# EAGLE design Sticker_Alignment_Jig (EAGLE 9.6.2)
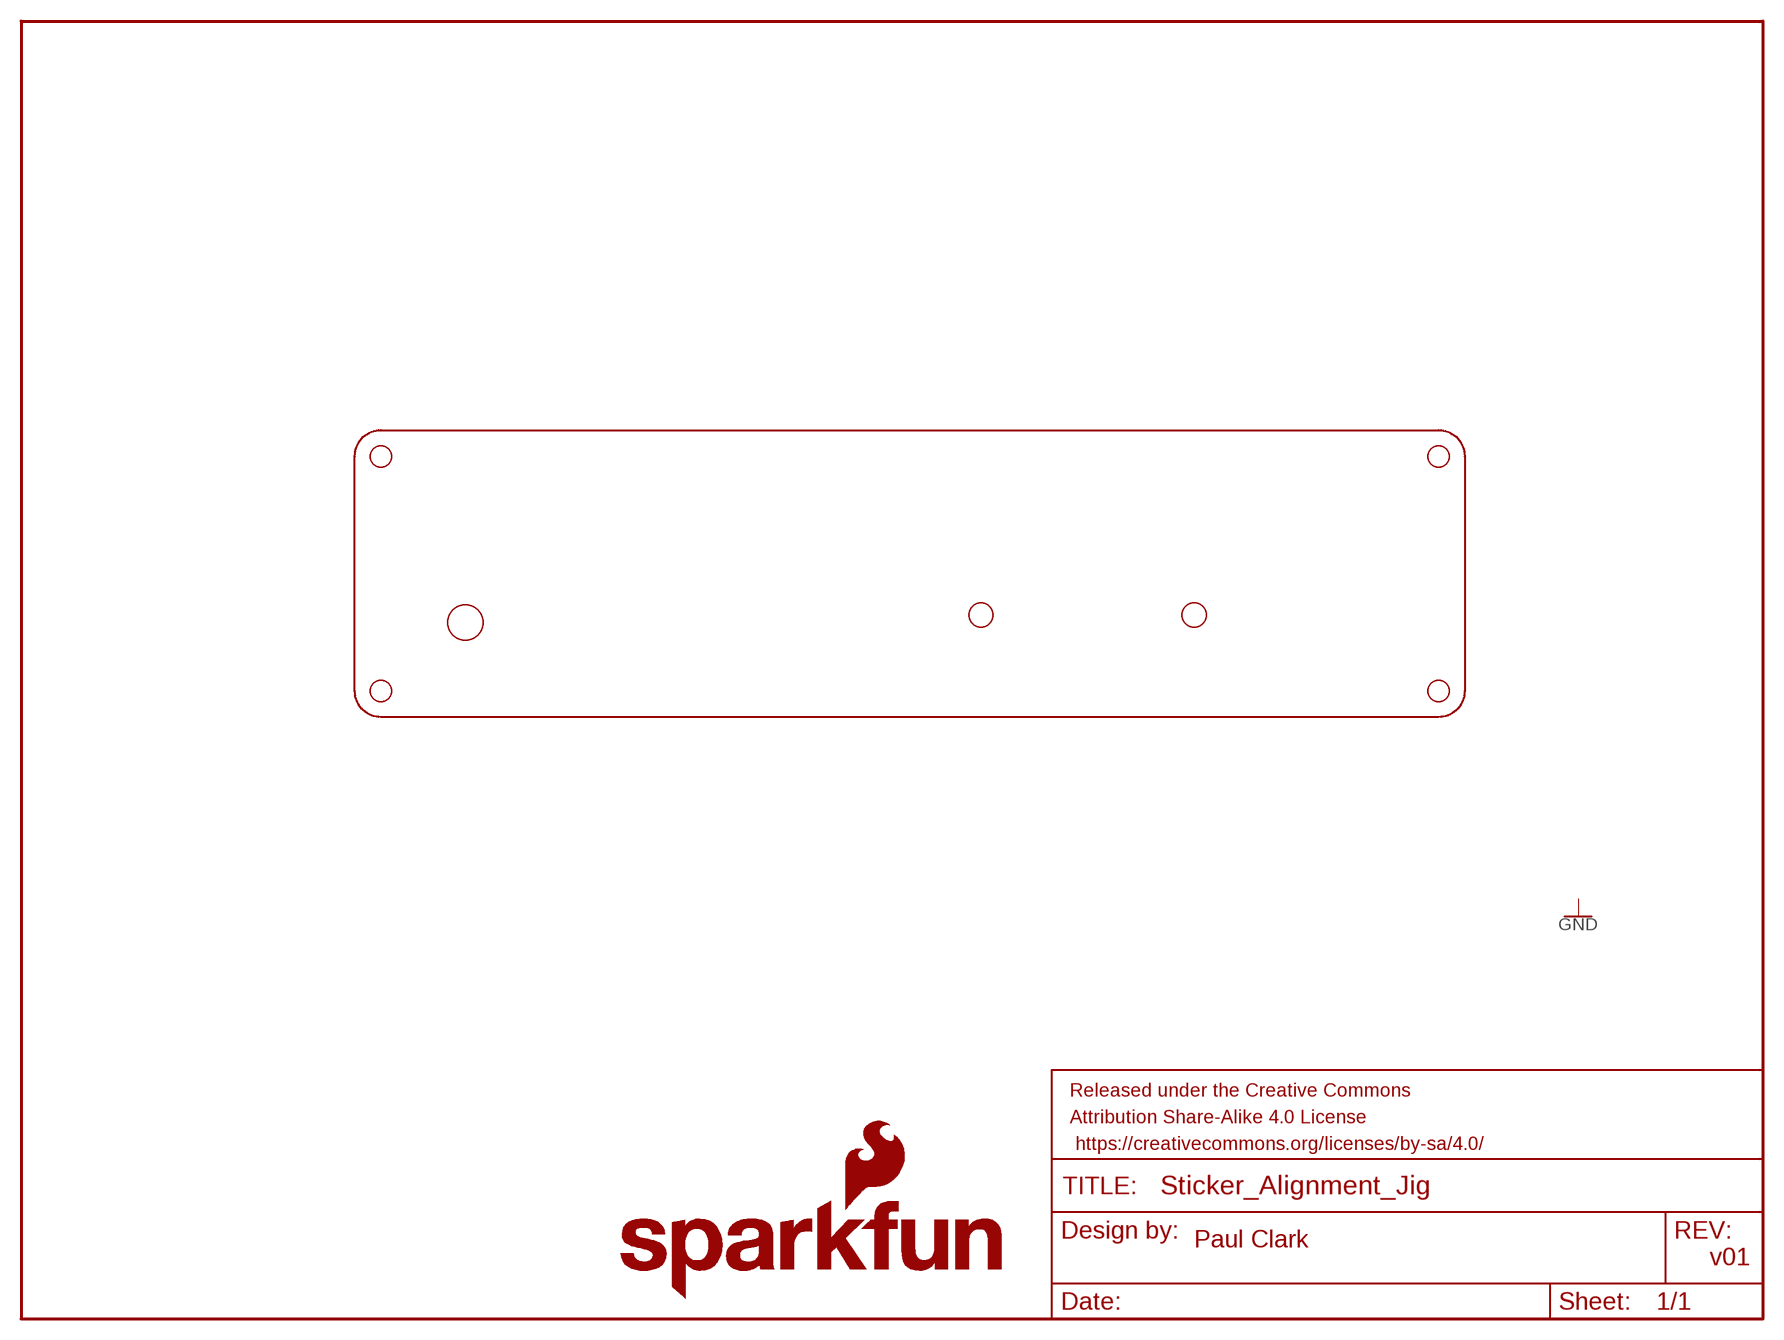
[diagram p0: schematic, sheet 1]

## Parts
FRAME1  FRAME-LETTER  [CREATIVE_COMMONS]
LOGO1  SFE_LOGO_NAME_FLAME.3_INCH  [SFE_LOGO_NAME_FLAME_.3]
U$2  PANEL_OUTLINE  [PANEL_OUTLINE]
U$3  LED  [LED]
U$13  BUTTON  [BUTTON]
U$14  BUTTON  [BUTTON]

## Notes on the sheet
- Paul Clark
- v01

## Library data of the parts
FRAME1 = SparkFun-Aesthetics:FRAME-LETTER: Schematic Frame - Letter Standard 8.5x11 US Letter frame
LOGO1 = SparkFun-Aesthetics:SFE_LOGO_NAME_FLAME: SparkFun Font Logo w/ Flame This is the SparkFun full logo. The logo on the schematic will always be the same size; the package variant is the height of the flame part of the logo. Default layer for the logo on the board is tSilk.
U$2 = CORS_Panels:PANEL_OUTLINE: Panel Outline Centered on the top surface of the PCB
U$3 = CORS_Panels:LED
U$13 U$14 = CORS_Panels:BUTTON

## Board
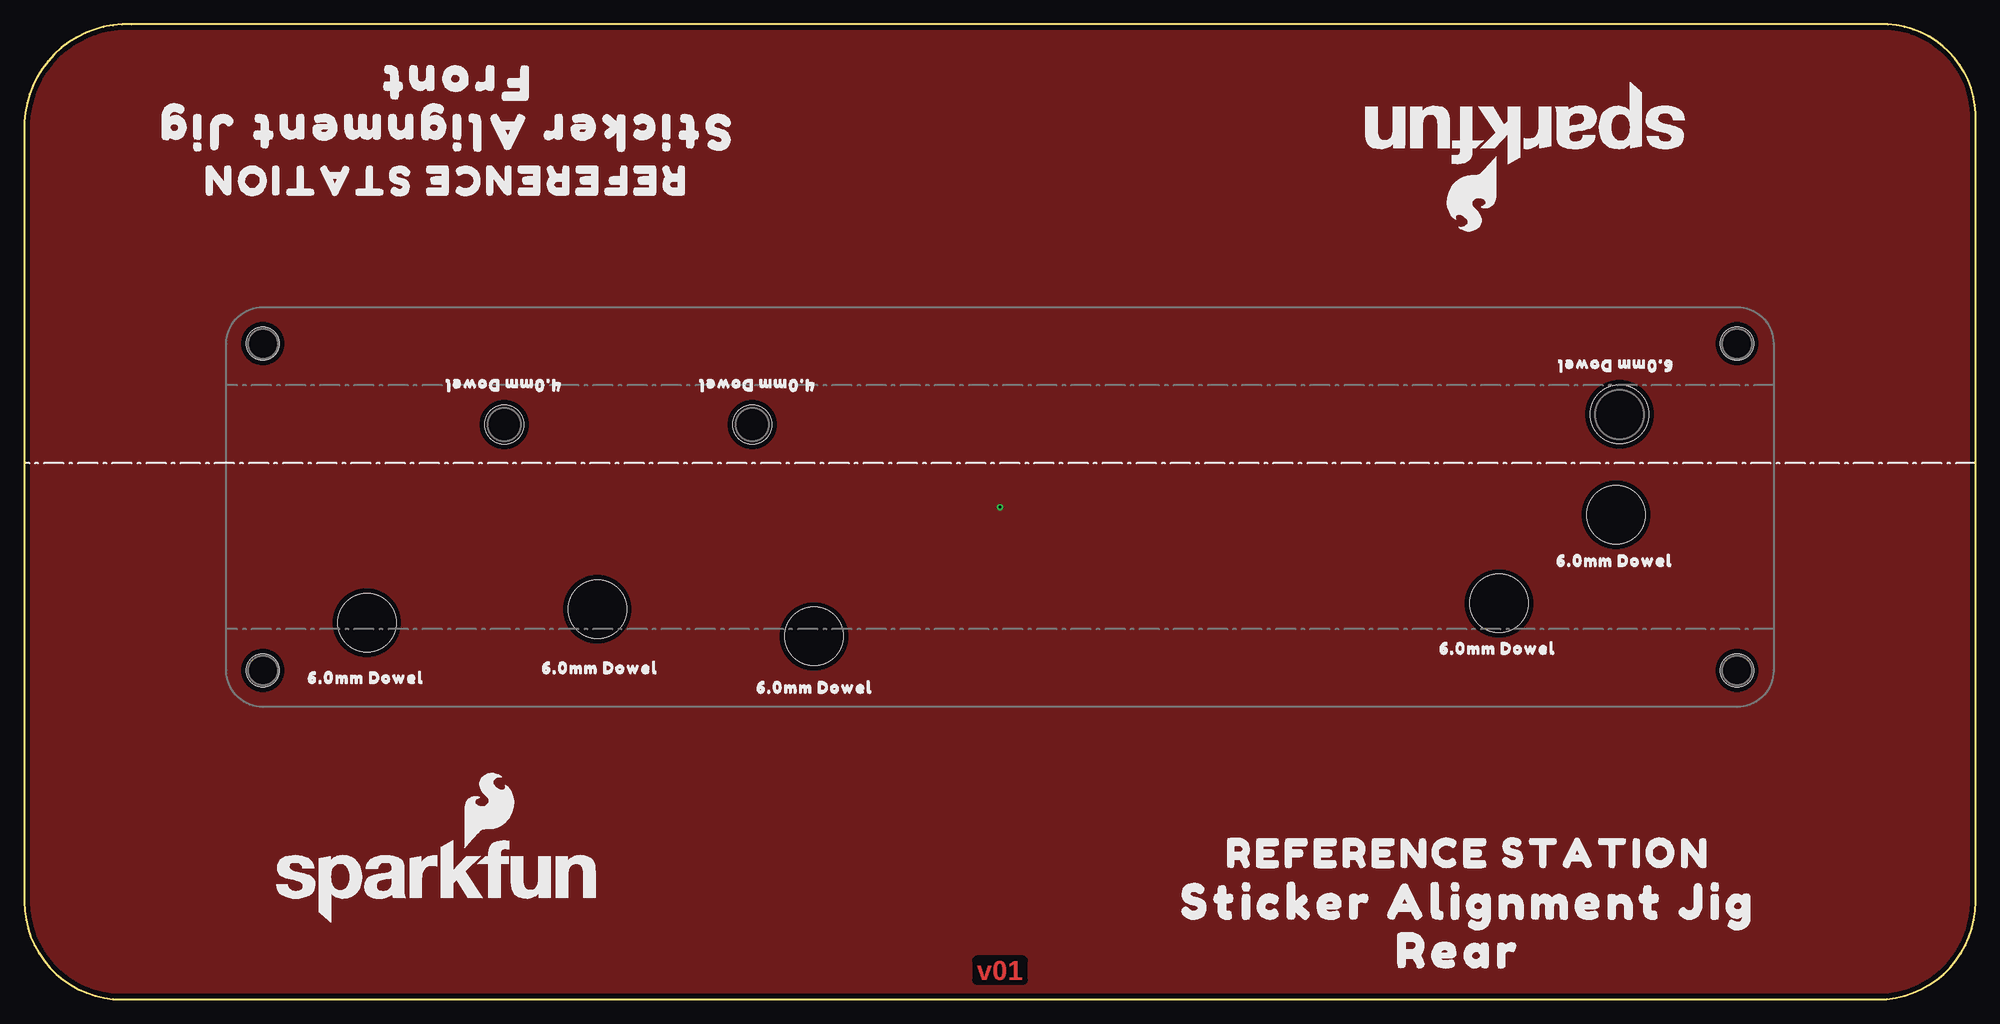
[diagram p1: board, top side]
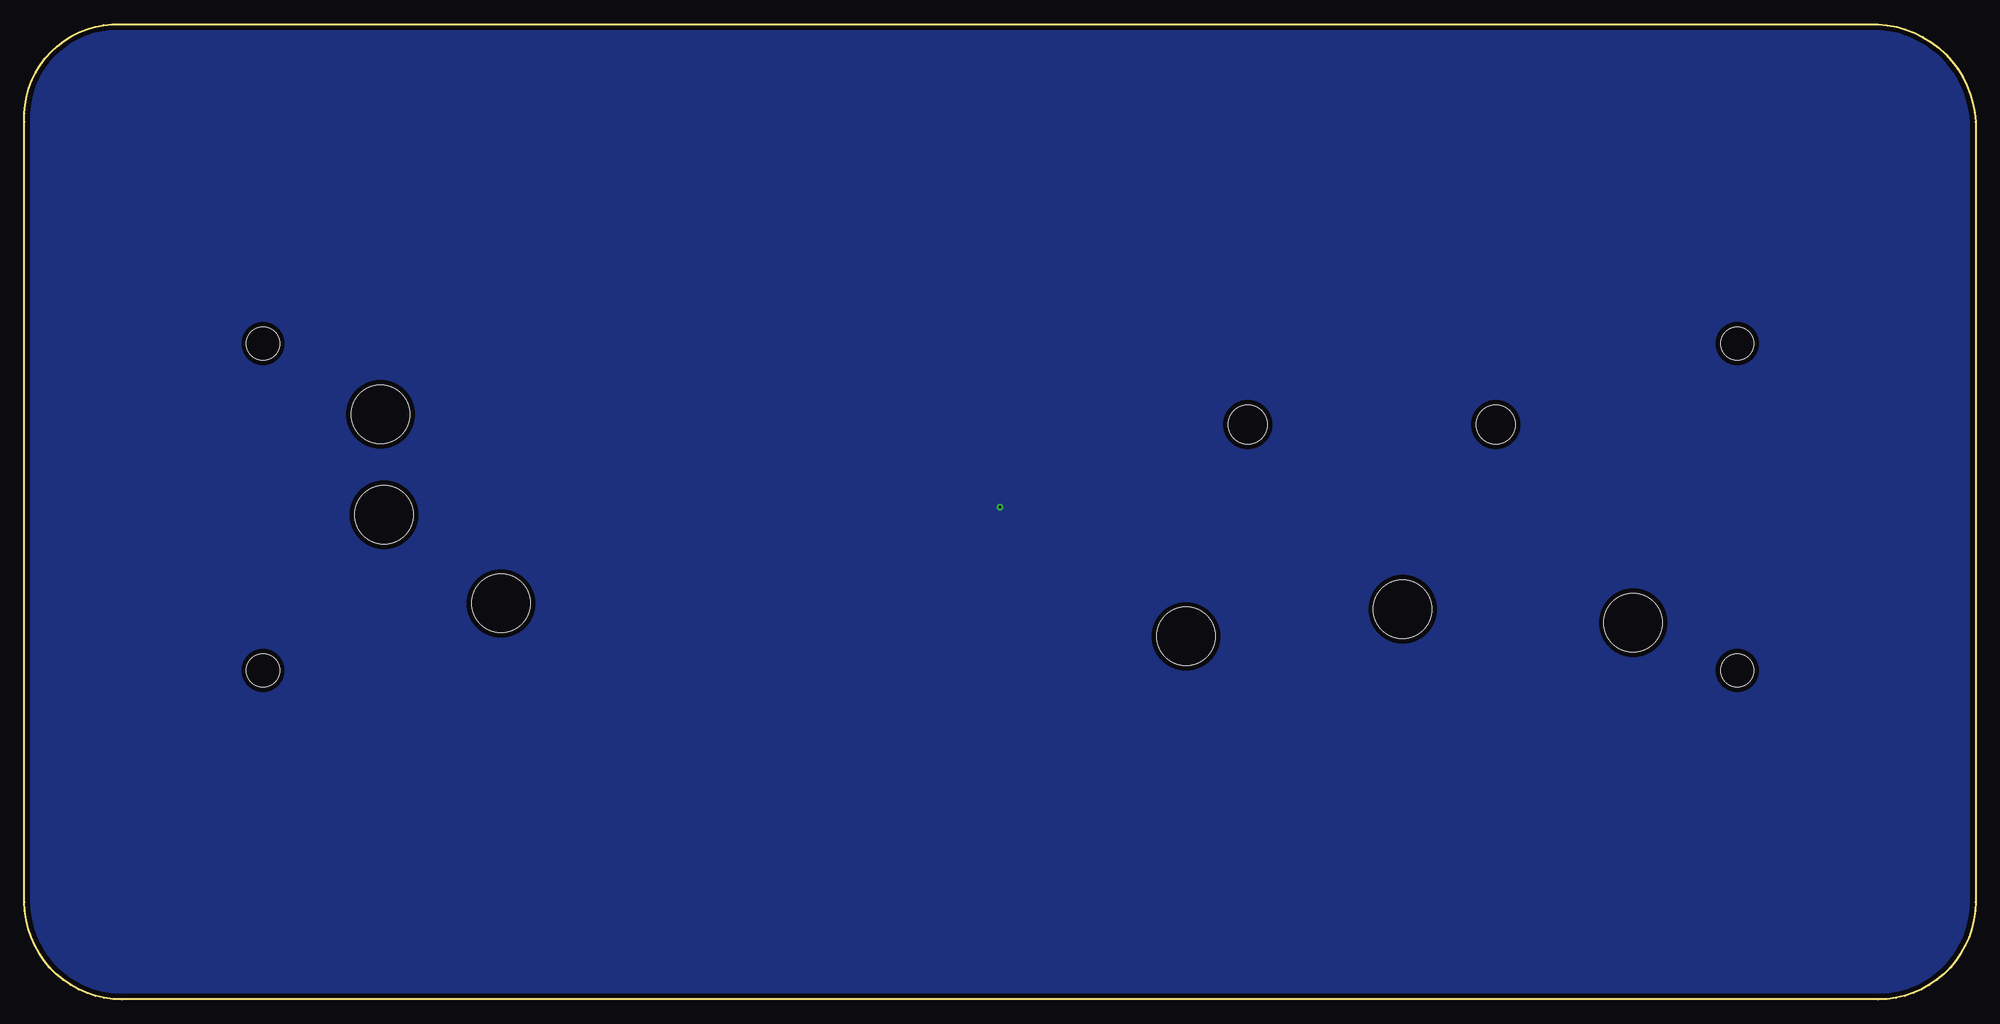
[diagram p2: board, bottom side, seen from below]

Size 200.01 x 100 mm. Coordinates in mm from the lower left corner, seen from the top.
Outline: 0,10 arc90 10,0 190,0 arc90 200,10 200,90 arc90 191,100 11,100 arc90 0,90 0,10
Copper layers (1*16): Top 0.035mm / dielectric 1.5mm / Bottom 0.035mm
Design rules "SparkFun-2-Layer-General-JLCPCB": minimum track width 7mil, minimum drill 0.3mm, track to track 7mil, track to pad 7mil, pad to pad 7mil, via to via 7mil, smd to smd 7mil, copper to edge 7mil, drill to drill 7mil, minimum pad ring 7mil, minimum via ring 7mil, stop-mask expansion 3mil, vias tented up to drill 25mil, thermal gap 10mil
Holes 6 mm at 151.15,40.62 163.15,49.73 35.1,38.63 58.73,40.03 80.95,37.23

### Footprints (pad centres in the part's own frame; a part is rotated, then mirrored left to right if it is on the bottom)
PANEL_OUTLINE = hole 3.4: -75.55,29.25; 75.55,29.25; 75.55,-4.25; -75.55,-4.25
LED = hole 6: 0,3
BUTTON = hole 4: 0,4.05

### Placement (x,y rotation side)
FRAME1  75,-9 0 top  (outside the outline)
LOGO1  42.15,12.09 0 top
LOGO2  SFE_LOGO_NAME_FLAME.3_INCH  [SFE_LOGO_NAME_FLAME_.3]  153.85,89.91 180 top
U$1  [REFERENCE_STATION0]  148,15 0 top
U$2  100,63 180 top
U$3  163.5,63 180 top
U$4  [4#0MM_DOWEL0]  75,63 180 top
U$5  [STICKER_ALIGNMENT_JIG0]  148,10 0 top
U$6  [6#0MM_DOWEL0]  163,45 0 top
U$7  [6#0MM_DOWEL0]  151,36 0 top
U$8  [6#0MM_DOWEL0]  35,33 0 top
U$9  [REFERENCE_STATION0]  43,84 180 top
U$10  [STICKER_ALIGNMENT_JIG0]  43,89 180 top
U$11  [6#0MM_DOWEL0]  163,65 180 top
U$12  [4#0MM_DOWEL0]  49,63 180 top
U$13  49.2,63 180 top
U$14  74.6,63 180 top
U$19  [6#0MM_DOWEL0]  59,34 0 top
U$20  [6#0MM_DOWEL0]  81,32 0 top
U$21  [FRONT0]  44,94 180 top
U$22  [REAR0]  147,5 0 top

### Tracks (layer width: path | path; a pad name or v marks a point on that pad's centre or on a via)
GND  (via drill 0.3)
  other vias: 100,50.5
  pour Top (isolate 0.5, no thermals): 0,100 200,100 200,0 0,0
  pour Bottom (isolate 0.5, no thermals): 0,100 200,100 200,0 0,0

### Text on the board
Top: v01